# EAGLE schematic Control Logic (EAGLE 7.5.0)
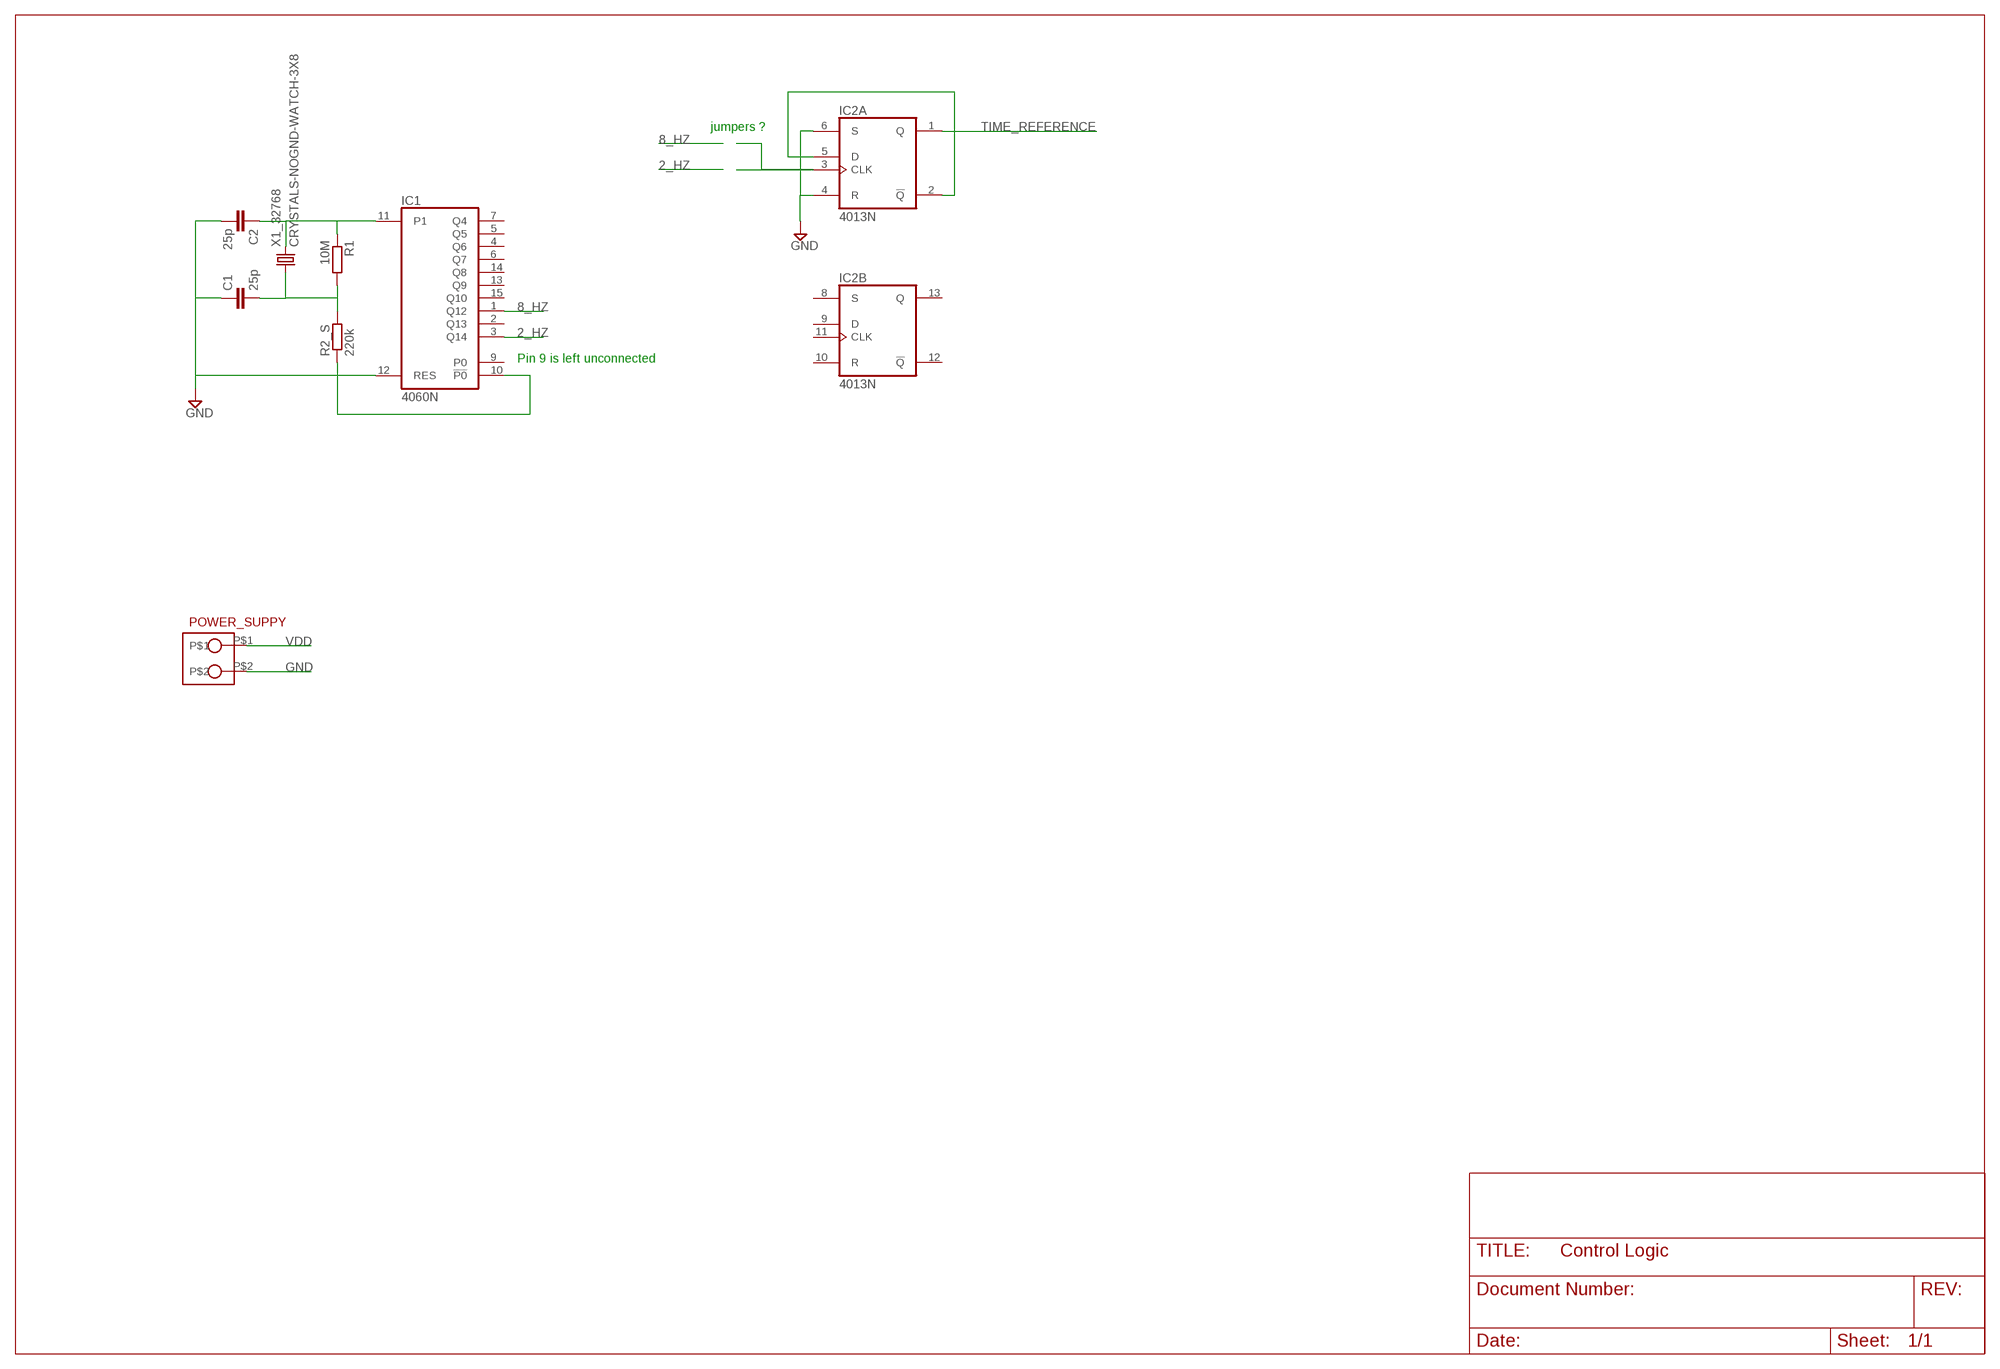
[diagram p0: schematic, sheet 1]

## Parts
C1  25p  C-EU050-025X075  [C050-025X075]
C2  25p  C-EU050-025X075  [C050-025X075]
IC1  4060N  [DIL16]
IC2  4013N  [DIL14]
POWER_SUPPY  CON_2_SIL  [SIL_2_0.2INCH]
R1  10M  R-EU_0207/10  [0207/10]
R2_S  220k  R-EU_0207/10  [0207/10]
X1_32768  CRYSTALS-NOGND-WATCH-3X8  [WATCH-3X8]

## Nets
2_HZ: IC1.3(Q14)
8_HZ: IC1.1(Q12)
GND: C1.1 C2.2 IC1.12(RES) IC2.4(A:R) IC2.6(A:S) POWER_SUPPY.P$2
N$1: C2.1 IC1.11(P1) R1.1 X1_32768.2
N$2: C1.2 R1.2 R2_S.2 X1_32768.1
N$3: IC1.10(!P0) R2_S.1
N$4: IC2.3(A:CLK)
N$5: IC2.2(A:!Q) IC2.5(A:D)
TIME_REFERENCE: IC2.1(A:Q)
VDD: POWER_SUPPY.P$1
Unconnected: IC1.2(Q13) IC1.4(Q6) IC1.5(Q5) IC1.6(Q7) IC1.7(Q4) IC1.9(P0) IC1.13(Q9) IC1.14(Q8) IC1.15(Q10) IC2.8(B:S) IC2.9(B:D) IC2.10(B:R) IC2.11(B:CLK) IC2.12(B:!Q) IC2.13(B:Q)

## Notes on the sheet
- jumpers ?
- Pin 9 is left unconnected

## Power pins joined to a net without a drawn wire
VDD: IC1.16(VDD) IC2.14(P:VDD)
VSS: IC1.8(VSS) IC2.7(P:VSS)

## Library data of the parts
C1 C2 = resistor:C-EU: CAPACITOR, European symbol
IC1 = 40xx:4060: 14-stage binary/ripple COUNTER
IC2 = 40xx:4013: Dual D FLIP FLOP, set/reset
POWER_SUPPY = PGT:CON_2_SIL: Connecteur à 2 pattes, avec un écart de 0.2 inc (soit 5.08 mm).
R1 R2_S = resistor:R-EU_: RESISTOR, European symbol
X1_32768 = IQD-Frequency-Products:CRYSTALS-NOGND: CRYSTALS CAN NOT GROUNDED